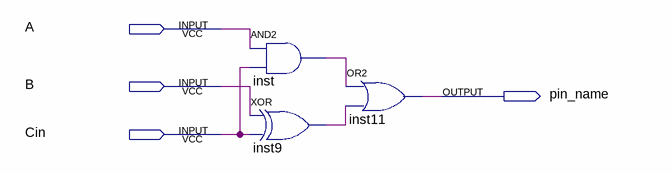
[diagram p0: schematic sheet]
// Quartus schematic 20201030.bdf as structural Verilog: 3 symbols, 4 pins
module \20201030  (
  input  A,
  input  B,
  input  Cin,
  output pin_name
);

  wire inst9_out, inst_out;

  and inst (inst_out, A, Cin);
  xor inst9 (inst9_out, B, Cin);
  or inst11 (pin_name, inst_out, inst9_out);
endmodule
